# Altium schematic sheet Environmental.SchDoc
size A4
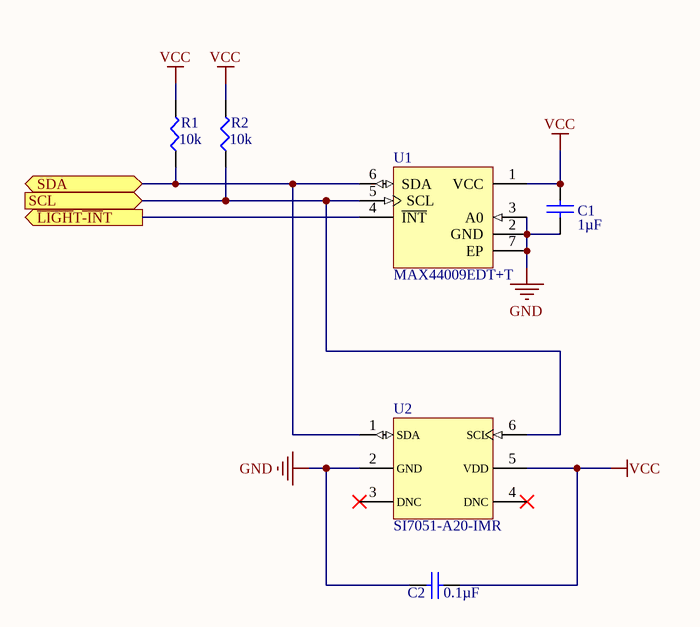
[diagram p0: Environmental.SchDoc]

## Parts
C1  Capacitance: 1µF  [C0603N]  (hidden comment: CL10B105KP8NFNC)
C2  Capacitance: 0.1µF  [C0603N]  (hidden comment: CL10B104KO8NFNC)
R1  value 10k  [SMD-0603-RES]  (hidden comment: ERJ-3EKF1002V)
R2  value 10k  [SMD-0603-RES]  (hidden comment: ERJ-3EKF1002V)
U1  MAX44009EDT+T  [21-0490D]
U2  SI7051-A20-IMR  [si705x-hand]

## Ports
SCL (in), SDA (bidir), ~{LIGH}T~{-IN}T (out)

## Nets
GND: C1.1 C2.1 U1.2(GND) U1.3(A0) U1.7(EP) U2.2(GND)
VCC: C1.2 C2.2 R1.2 R2.2 U1.1(VCC) U2.5(VDD)
~{LIGH}T~{-IN}T: U1.4(~{INT}) ; port ~{LIGH}T~{-IN}T
SCL: R2.1 U1.5(SCL) U2.6(SCL) ; port SCL
SDA: R1.1 U1.6(SDA) U2.1(SDA) ; port SDA

Not connected (* = marked no-connect by the designer): U2 3(DNC)* 4(DNC)*

## Library data of the parts
C1 = CAPACITOR_NP: CAP CER 1UF 10V X7R 0603; HOUSEPART: NO; POPULATE: 1; TOLERANCE: ±10%; VOLTAGE: 16V; DeviceName: CL10B105KP8NFNC; LibraryName: MF_Passives; DeviceSetName: CAPACITOR_NP; MPN: CL10B105KP8NFNC; URL: https://octopart.com/cl10b104ko8nfnc-samsung-19831587; MF_PARTNUM: CL10B105KP8NFNC; Temperature Coefficient: X7R
C2 = CAPACITOR_NP: HOUSEPART: NO; POPULATE: 1; TOLERANCE: ±10%; VOLTAGE: 16V; Temperature Coefficient: X7R; DeviceName: CL10B104KO8NFNC; LibraryName: MF_Passives; DeviceSetName: CAPACITOR_NP; MPN: CL10B104KO8NFNC; URL: https://octopart.com/cl10b104ko8nfnc-samsung-19831587; MF_PARTNUM: CL10B104KO8NFNC
R1 R2 = ERJ-3EKF1002V: RES SMD 10K OHM 1% 1/10W 0603; Manufacturer: Panasonic Electronic Components; Factory Stock: 0; Unit Price (USD): 0.00379; @ qty: 1500; Minimum Quantity: 1; Power (Watts): 0.1W, 1/10W; Temperature Coefficient: ±100ppm/°C; Part Number: ERJ-3EKF1002V; Datasheets: http://industrial.panasonic.com/www-cgi/jvcr13pz.cgi?E+PZ+3+AOA0002+ERJ3EKF1002V+7+WW; Image: //media.digikey.com/Photos/Panasonic%20Photos/MFG_ERJ-P6W%20Series.jpg; Digi-Key Part Number: P10.0KHCT-ND; Quantity Available: 6703141; Packaging: Cut Tape (CT); Series: ERJ; Part Status: Active; Tolerance: ±1%; Composition: Thick Film; Features: Automotive AEC-Q200; Operating Temperature: -55°C ~ 155°C; Package / Case: 0603 (1608 Metric); Supplier Device Package: 0603; Size / Dimension: 0.063" L x 0.031" W (1.60mm x 0.80mm); Height - Seated (Max): 0.022" (0.55mm); Number of Terminations: 2; Failure Rate: -
U1 = MAX44009EDT+T: MAX44009 light sensor; Octopart Url: https://octopart.com/max44009edt%2Bt-maxim+integrated-44380498; Manufacturer Part Number: MAX44009EDT+T; Lifecycle Status: Active; OctopartID: e71f2cb0f32b38d8; Case/Package: 6-UDFN
U2 = CMP-6e6fa3261226b1a8-2: Temperature Sensor tal, Local -40°C ~ 125°C 14 b 6-DFN (3x3); Octopart URL: https://octopart.com/si7051-a20-im-silicon+labs-71522607; RoHS: Compliant; Case/Package: 6-DFN; Manufacturer Part Number: SI7051-A20-IMR